# Altium project be_mdv.PrjPcb
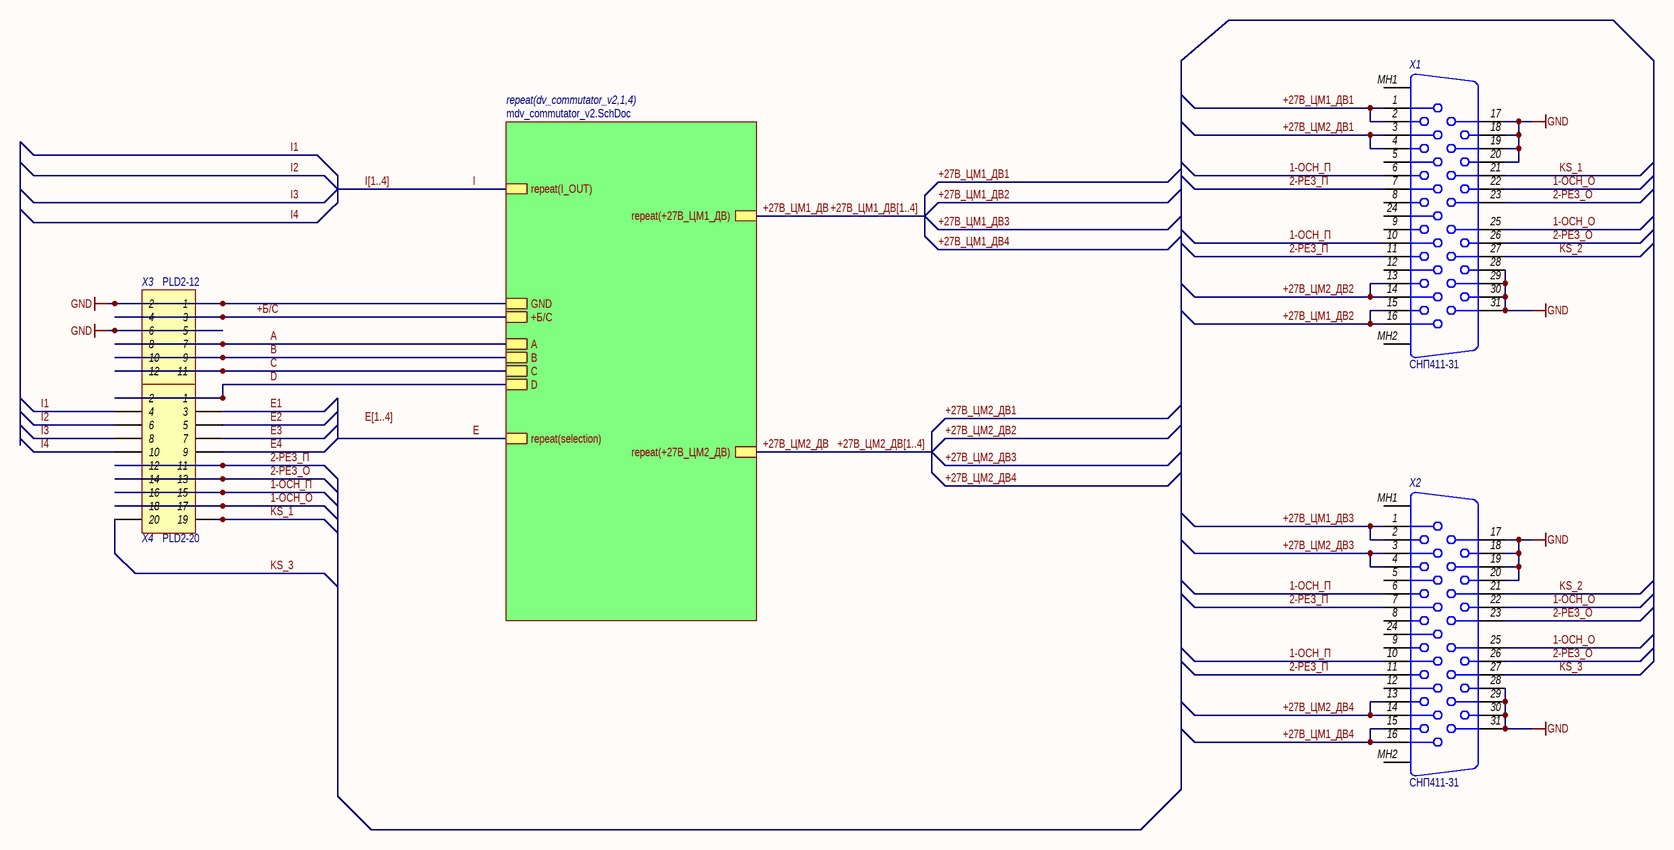
[diagram p0: be_mdv.SchDoc]
Утвердил: Прокопьев; Т.Контр.: Селезнев; Разработал: Пелемешко; Проверил: Стюф; Норм.Контр.: Задорожная; GlobalProjectRevision: #1.0; GlobalProjectNumber: ЮМП.250.270.041.05 Э3; GlobalProjectName3: Модуль датчиков вибрации; GlobalProjectName2: принципиальная.; GlobalProjectName1: Схема электрическая; GlobalOrganizationName: НГУ
2 sheets, 140 parts. Net scope: hierarchical (ports join the sheet entries above them; power ports are global).
Board file: be_mdv.PcbDoc
Sheets:
  be_mdv.SchDoc
    dv_commutator_v21 = mdv_commutator_v2.SchDoc
    dv_commutator_v22 = mdv_commutator_v2.SchDoc
    dv_commutator_v23 = mdv_commutator_v2.SchDoc
    dv_commutator_v24 = mdv_commutator_v2.SchDoc

## Sheet be_mdv.SchDoc: =GlobalProjectName
size 410 x 297 mm; ApprovedBy: Прокопьев; CheckedBy: Стюф; Author: Пелемешко; Organization: НГУ; DocumentNumber: 1; Revision: #1.0; SheetNumber: 1; SheetTotal: 2; PageSetup: Record=PageOptions|CenterHorizontal=True|CenterVertical=True|PrintScale=1.00|XCorrection=1.00|YCorrection=1.00|PrintKind=1|BorderSize=5000000|LeftOffset=0|BottomOffset=0|Orientation=2|PaperLength=1000|PaperWidth=1000|Scale=100|PaperSource=15|PrintQuality=1200|MediaType=1|DitherType=10|PaperKind=A3|PrintScaleMode=1; Weight: -; ScaleFactor: -; NormInspection: Задорожная; FirstApplication: ЮМП.250.270.041.05 Э3

### Parts
X1  SNP411-31  [SNP411-31]  (value not drawn)
X2  SNP411-31  [SNP411-31]  (value not drawn)
X3  Header 2X12  [PLD2-12]  (value not drawn)
X4  Header 2X20  [PLD2-20]  (value not drawn)

### Sub-sheets
repeat(dv_commutator_v2,1,4) = mdv_commutator_v2.SchDoc: repeat(+27В_ЦМ2_ДВ), GND, repeat(+27В_ЦМ1_ДВ), +Б/С, repeat(selection), A, C, B, D, repeat(I_OUT)

### Nets
GND: X1.17 X1.18 X1.19 X1.20 X1.28 X1.29 X1.30 X1.31 X2.17 X2.18 X2.19 X2.20 X2.28 X2.29 X2.30 X2.31 X3.1 X3.2 X3.5 X3.6 ; sheet repeat(dv_commutator_v2,1,4)/GND
1-ОСН_О: X1.22 X1.25 X2.22 X2.25 X4.17 X4.18
1-ОСН_П: X1.6 X1.10 X2.6 X2.10 X4.15 X4.16
2-РЕЗ_О: X1.23 X1.26 X2.23 X2.26 X4.13 X4.14
2-РЕЗ_П: X1.7 X1.11 X2.7 X2.11 X4.11 X4.12
+27В_ЦМ1_ДВ: sheet repeat(dv_commutator_v2,1,4)/repeat(+27В_ЦМ1_ДВ)  [also labelled +27В_ЦМ1_ДВ[1..4]]
+27В_ЦМ1_ДВ1: X1.1 X1.2  [also labelled +27В_ЦМ1_ДВ[1..4]1]
+27В_ЦМ1_ДВ2: X1.15 X1.16  [also labelled +27В_ЦМ1_ДВ[1..4]2]
+27В_ЦМ1_ДВ3: X2.1 X2.2  [also labelled +27В_ЦМ1_ДВ[1..4]3]
+27В_ЦМ1_ДВ4: X2.15 X2.16  [also labelled +27В_ЦМ1_ДВ[1..4]4]
+27В_ЦМ2_ДВ: sheet repeat(dv_commutator_v2,1,4)/repeat(+27В_ЦМ2_ДВ)  [also labelled +27В_ЦМ2_ДВ[1..4]]
+27В_ЦМ2_ДВ1: X1.3 X1.4  [also labelled +27В_ЦМ2_ДВ[1..4]1]
+27В_ЦМ2_ДВ2: X1.13 X1.14  [also labelled +27В_ЦМ2_ДВ[1..4]2]
+27В_ЦМ2_ДВ3: X2.3 X2.4  [also labelled +27В_ЦМ2_ДВ[1..4]3]
+27В_ЦМ2_ДВ4: X2.13 X2.14  [also labelled +27В_ЦМ2_ДВ[1..4]4]
+Б/С: X3.3 X3.4 ; sheet repeat(dv_commutator_v2,1,4)/+Б/С
A: X3.7 X3.8 ; sheet repeat(dv_commutator_v2,1,4)/A
B: X3.9 X3.10 ; sheet repeat(dv_commutator_v2,1,4)/B
C: X3.11 X3.12 ; sheet repeat(dv_commutator_v2,1,4)/C
D: X4.1 X4.2 ; sheet repeat(dv_commutator_v2,1,4)/D
E: sheet repeat(dv_commutator_v2,1,4)/repeat(selection)
E1: X4.3
E2: X4.5
E3: X4.7
E4: X4.9
I: sheet repeat(dv_commutator_v2,1,4)/repeat(I_OUT)
I1: X4.4
I2: X4.6
I3: X4.8
I4: X4.10
KS_1: X1.21 X4.19
KS_2: X1.27 X2.21
KS_3: X2.27 X4.20

Not connected (* = marked no-connect by the designer): X1 5 8 9 12 24 MH1 MH2; X2 5 8 9 12 24 MH1 MH2

### Buses and harness runs
bus E[1..4]
bus I[1..4]

### Notes on the sheet
- Labels drawn without touching a wire or pin: E[1..4]
- Перв. примен.
- Справ. №
- Подп. и дата
- Инв. № дубл.
- Взам. инв. №
- Изм.
- Разраб.
- Лист
- № докум.
- Подп.
- Дата
- Литера
- Масса
- Масштаб
- Пров.
- Т.контр.
- Листов
- Н.контр.
- Утв.
- Инв. № подл.
- Форма 1 ГОСТ 2.104-2006
- Копировал
- Формат А3

### Library data of the parts
X1 X2 = СНП411-31: СНП411-31, распиновка со стороны платы; Назначение: Соединитель угловой на плату; Наименование: СНП411-31
X3 = Header 2X12: Header, 12-Pin, Dual row; Потребление, Вт: 0,0; Назначение: Header, 12-Pin, Dual row; Наименование: PLD2-12
X4 = Header 2X20: Header, 20-Pin, Dual row; Потребление, Вт: 0,0; Назначение: Header, 20-Pin, Dual row; Наименование: PLD2-20

## Sheet mdv_commutator_v2.SchDoc
size 410 x 297 mm; DocumentNumber: 2; SheetNumber: 2; SheetTotal: 2; PageSetup: Record=PageOptions|CenterHorizontal=True|CenterVertical=True|PrintScale=1.00|XCorrection=1.00|YCorrection=1.00|PrintKind=1|BorderSize=5000000|LeftOffset=0|BottomOffset=0|Orientation=2|PaperLength=1000|PaperWidth=1000|Scale=100|PaperSource=15|PrintQuality=1200|MediaType=1|DitherType=10|PaperKind=A3|PrintScaleMode=1; Weight: -; ScaleFactor: -; NormInspection: Норм.Контр.; FirstApplication: ЮМП.250.270.041.05 Э3
Used 4 times, as channels dv_commutator_v21, dv_commutator_v22, dv_commutator_v23, dv_commutator_v24. Parts and nets are listed once, with the designators drawn on the sheet.
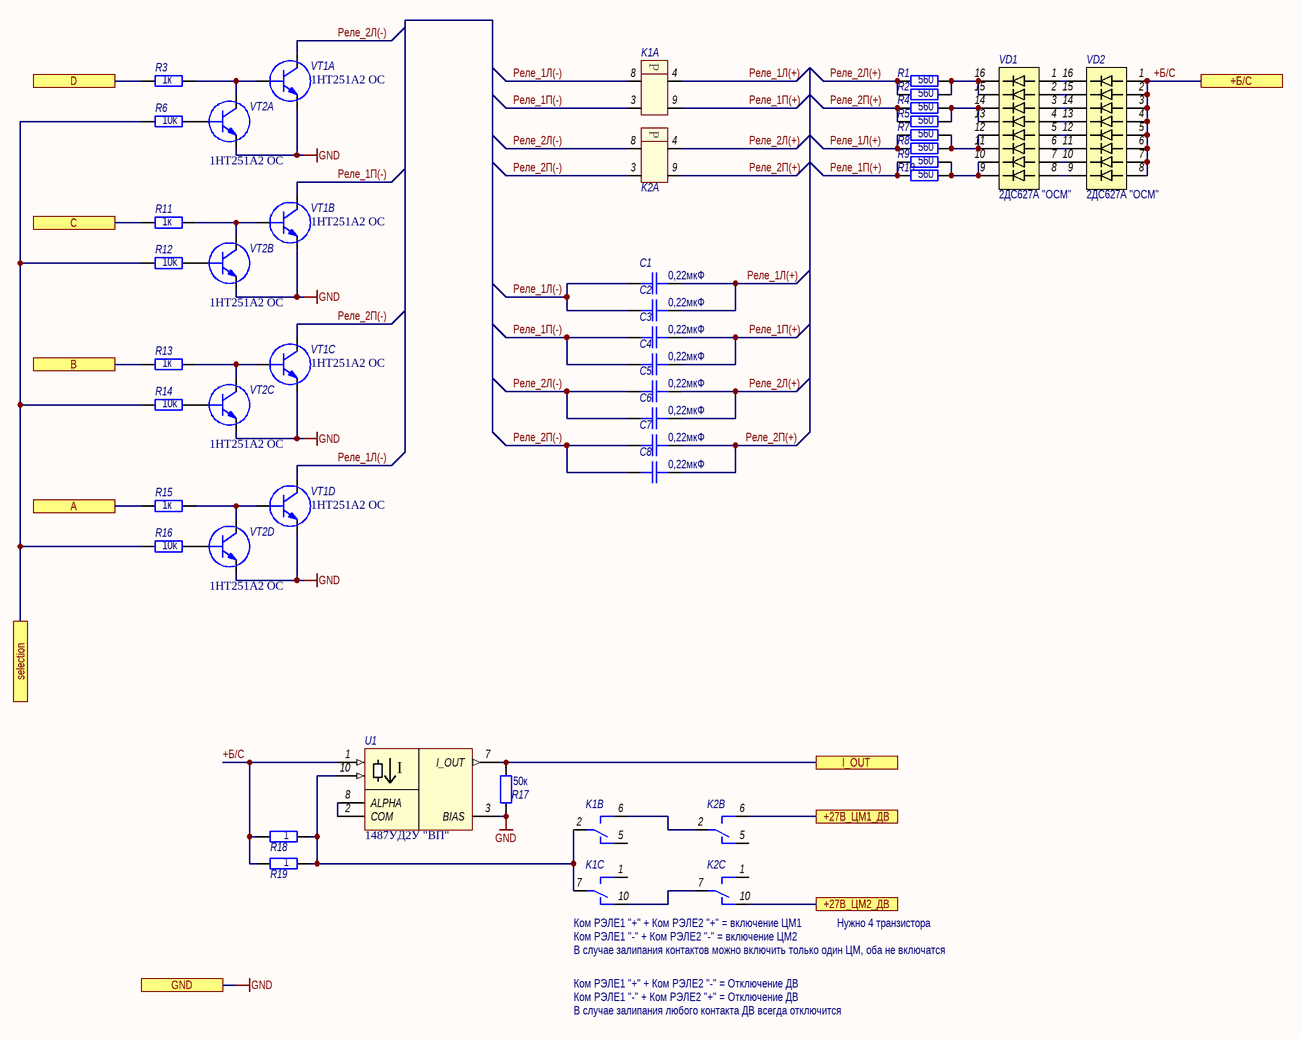
[diagram p1: mdv_commutator_v2.SchDoc]

### Parts
C1  value 0,22мкФ  [SMD_C0402]  (hidden comment: K10-79)
C2  value 0,22мкФ  [SMD_C0402]  (hidden comment: K10-79)
C3  value 0,22мкФ  [SMD_C0402]  (hidden comment: K10-79)
C4  value 0,22мкФ  [SMD_C0402]  (hidden comment: K10-79)
C5  value 0,22мкФ  [SMD_C0402]  (hidden comment: K10-79)
C6  value 0,22мкФ  [SMD_C0402]  (hidden comment: K10-79)
C7  value 0,22мкФ  [SMD_C0402]  (hidden comment: K10-79)
C8  value 0,22мкФ  [SMD_C0402]  (hidden comment: K10-79)
K1  RPS45-1-T-OS  [RPS-45-1]  (value not drawn)  (parts A,B,C of 3)
K2  RPS45-1-T-OS  [RPS-45-1]  (value not drawn)  (parts A,B,C of 3)
R1  value 560  [SMD_0805]  (hidden comment: OSM R1-12)
R2  value 560  [SMD_0805]  (hidden comment: OSM R1-12)
R3  value 1к  [SMD_0805]  (hidden comment: OSM R1-12)
R4  value 560  [SMD_0805]  (hidden comment: OSM R1-12)
R5  value 560  [SMD_0805]  (hidden comment: OSM R1-12)
R6  value 10k  [SMD_0805]  (hidden comment: OSM R1-12)
R7  value 560  [SMD_0805]  (hidden comment: OSM R1-12)
R8  value 560  [SMD_0805]  (hidden comment: OSM R1-12)
R9  value 560  [SMD_0805]  (hidden comment: OSM R1-12)
R10  value 560  [SMD_0805]  (hidden comment: OSM R1-12)
R11  value 1к  [SMD_0805]  (hidden comment: OSM R1-12)
R12  value 10k  [SMD_0805]  (hidden comment: OSM R1-12)
R13  value 1к  [SMD_0805]  (hidden comment: OSM R1-12)
R14  value 10k  [SMD_0805]  (hidden comment: OSM R1-12)
R15  value 1к  [SMD_0805]  (hidden comment: OSM R1-12)
R16  value 10k  [SMD_0805]  (hidden comment: OSM R1-12)
R17  value 50к  [SMD_0805]  (hidden comment: OSM R1-12)
R18  value 1  [SMD_0805]  (hidden comment: OSM R1-12)
R19  value 1  [SMD_0805]  (hidden comment: OSM R1-12)
U1  Наименование: 1487УД2У "ВП"  [FlatPack-10]  (hidden comment: 1487UD2U)
VD1  Наименование: 2ДС627А "ОСМ"  [401.16-3]  (hidden comment: 2DS627A OSM)
VD2  Наименование: 2ДС627А "ОСМ"  [401.16-3]  (hidden comment: 2DS627A OSM)
VT1  Наименование: 1НТ251А2 ОС  [FlatPack-14.PcbLib]  (hidden comment: 1NT251A2 OS)  (parts A,B,C,D of 4)
VT2  Наименование: 1НТ251А2 ОС  [FlatPack-14.PcbLib]  (hidden comment: 1NT251A2 OS)  (parts A,B,C,D of 4)

### Ports
+27В_ЦМ1_ДВ, +27В_ЦМ2_ДВ, +Б/С, A, B, C, D, GND, I_OUT, selection

### Nets
GND: R17.1 U1.3(BIAS) VT1.3(E) VT1.6(E) VT1.10(E) VT1.13(E) VT2.3(E) VT2.6(E) VT2.10(E) VT2.13(E) ; port GND
+27В_ЦМ1_ДВ: K2.6 ; port +27В_ЦМ1_ДВ
+27В_ЦМ2_ДВ: K2.10 ; port +27В_ЦМ2_ДВ
+Б/С: R18.2 R19.2 U1.1(V+) VD2.1(1A) VD2.2(1B) VD2.3(1C) VD2.4(1D) VD2.5(1E) VD2.6(1F) VD2.7(1G) VD2.8(1H) ; port +Б/С
A: R15.1 ; port A
B: R13.1 ; port B
C: R11.1 ; port C
D: R3.1 ; port D
I_OUT: R17.2 U1.7(I_OUT) ; port I_OUT
selection: R6.1 R12.1 R14.1 R16.1 ; port selection
Реле_1Л(+): C1.2 C2.2 K1.4 R7.1 R8.1
Реле_1Л(-): C1.1 C2.1 K1.8 VT1.7(C)
Реле_1П(+): C3.2 C4.2 K1.9 R9.1 R10.1
Реле_1П(-): C3.1 C4.1 K1.3 VT1.4(C)
Реле_2Л(+): C5.2 C6.2 K2.4 R1.1 R2.1
Реле_2Л(-): C5.1 C6.1 K2.8 VT1.14(C)
Реле_2П(+): C7.2 C8.2 K2.9 R4.1 R5.1
Реле_2П(-): C7.1 C8.1 K2.3 VT1.11(C)
NetK1_2: K1.2 K1.7 R18.1 R19.1 U1.10(V_SENSE)
NetK1_6: K1.6 K2.2
NetK1_10: K1.10 K2.7
NetR1_2: R1.2 R2.2 VD1.15(2B) VD1.16(2A)
NetR3_2: R3.2 VT1.2(B) VT2.14(C)
NetR4_2: R4.2 R5.2 VD1.13(2D) VD1.14(2C)
NetR6_2: R6.2 VT2.2(B)
NetR7_2: R7.2 R8.2 VD1.11(2F) VD1.12(2E)
NetR9_2: R9.2 R10.2 VD1.9(2G) VD1.10(2G)
NetR11_2: R11.2 VT1.12(B) VT2.4(C)
NetR12_2: R12.2 VT2.12(B)
NetR13_2: R13.2 VT1.5(B) VT2.11(C)
NetR14_2: R14.2 VT2.5(B)
NetR15_2: R15.2 VT1.9(B) VT2.7(C)
NetR16_2: R16.2 VT2.9(B)
NetU1_2: U1.2(COM) U1.8(ALPHA)
NetVD1_1: VD1.1(1A) VD2.16(2A)
NetVD1_2: VD1.2(1B) VD2.15(2B)
NetVD1_3: VD1.3(1C) VD2.14(2C)
NetVD1_4: VD1.4(1D) VD2.13(2D)
NetVD1_5: VD1.5(1E) VD2.12(2E)
NetVD1_6: VD1.6(1F) VD2.11(2F)
NetVD1_7: VD1.7(1G) VD2.10(2G)
NetVD1_8: VD1.8(1H) VD2.9(2G)

Not connected (* = marked no-connect by the designer): K1 1 5; K2 1 5

### Channels
dv_commutator_v21: designators C1=C1 C2=C2 C3=C3 C4=C4 C5=C5 C6=C6 C7=C7 C8=C8 K1=K1 K2=K2 R1=R2 R2=R3 R3=R1 R4=R4 R5=R6 R6=R5 R7=R7 R8=R8 R9=R9 R10=R10 R11=R11 R12=R12 R13=R13 R14=R14 R15=R15 R16=R16 R17=R17 R18=R18 R19=R19 U1=U1 VD1=VD1 VD2=VD2 VT1=VT2 VT2=VT1; ports +27В_ЦМ1_ДВ=+27В_ЦМ1_ДВ1 +27В_ЦМ2_ДВ=+27В_ЦМ2_ДВ1 +Б/С=+Б/С A=A B=B C=C D=D GND=GND I_OUT=I1 selection=E1
dv_commutator_v22: designators C1=C9 C2=C10 C3=C11 C4=C12 C5=C13 C6=C14 C7=C15 C8=C16 K1=K3 K2=K4 R1=R21 R2=R22 R3=R20 R4=R23 R5=R25 R6=R24 R7=R26 R8=R27 R9=R28 R10=R29 R11=R30 R12=R31 R13=R32 R14=R33 R15=R34 R16=R35 R17=R36 R18=R37 R19=R38 U1=U2 VD1=VD3 VD2=VD4 VT1=VT4 VT2=VT3; ports +27В_ЦМ1_ДВ=+27В_ЦМ1_ДВ2 +27В_ЦМ2_ДВ=+27В_ЦМ2_ДВ2 +Б/С=+Б/С A=A B=B C=C D=D GND=GND I_OUT=I2 selection=E2
dv_commutator_v23: designators C1=C17 C2=C18 C3=C19 C4=C20 C5=C21 C6=C22 C7=C23 C8=C24 K1=K5 K2=K6 R1=R40 R2=R41 R3=R39 R4=R42 R5=R44 R6=R43 R7=R45 R8=R46 R9=R47 R10=R48 R11=R49 R12=R50 R13=R51 R14=R52 R15=R53 R16=R54 R17=R55 R18=R56 R19=R57 U1=U3 VD1=VD5 VD2=VD6 VT1=VT6 VT2=VT5; ports +27В_ЦМ1_ДВ=+27В_ЦМ1_ДВ3 +27В_ЦМ2_ДВ=+27В_ЦМ2_ДВ3 +Б/С=+Б/С A=A B=B C=C D=D GND=GND I_OUT=I3 selection=E3
dv_commutator_v24: designators C1=C25 C2=C26 C3=C27 C4=C28 C5=C29 C6=C30 C7=C31 C8=C32 K1=K7 K2=K8 R1=R59 R2=R60 R3=R58 R4=R61 R5=R63 R6=R62 R7=R64 R8=R65 R9=R66 R10=R67 R11=R68 R12=R69 R13=R70 R14=R71 R15=R72 R16=R73 R17=R74 R18=R75 R19=R76 U1=U4 VD1=VD7 VD2=VD8 VT1=VT8 VT2=VT7; ports +27В_ЦМ1_ДВ=+27В_ЦМ1_ДВ4 +27В_ЦМ2_ДВ=+27В_ЦМ2_ДВ4 +Б/С=+Б/С A=A B=B C=C D=D GND=GND I_OUT=I4 selection=E4

### Notes on the sheet
- Ком РЭЛЕ1 "+" + Ком РЭЛЕ2 "+" = включение ЦМ1
- Ком РЭЛЕ1 "-" + Ком РЭЛЕ2 "-" = включение ЦМ2
- Нужно 4 транзистора
- Ком РЭЛЕ1 "+" + Ком РЭЛЕ2 "-" = Отключение ДВ
- Ком РЭЛЕ1 "-" + Ком РЭЛЕ2 "+" = Отключение ДВ
- В случае залипания контактов можно включить только один ЦМ, оба не включатся
- В случае залипания любого контакта ДВ всегда отключится
- Подп. и дата
- Инв. № дубл.
- Взам. инв. №
- Инв. № подл.
- Изм.
- Лист
- № докум.
- Подп.
- Дата
- Форма 2а ГОСТ 2.104-2006
- Копировал
- Формат А3
- (in symbol AD8212S) I
- (in symbol RPS45, part A) P

### Library data of the parts
C1-C8 = Capacitor: Назначение: SMD-конденсатор; Наименование: К10-79; Потребление, Вт: 0; Напряжение: В; Точность: %
K1 K2 = RPS45: Реле поляризованное; Потребление, Вт: 0,000; Наименование: РПС45-1-Т-ОС РС4.520.756-11; Назначение: Реле поляризованное; ComponentLink1Description: DataSheet; ComponentLink1URL: https://relays.ru/files/catalog/rps45.pdf
R1-R19 = Resistor: Наименование: ОСМ Р1-12; Назначение: SMD-резистор; Потребление, Вт: 0,001; Точность: %
U1 = AD8212S: Назначение: Токовый датчик
VD1 VD2 = 2DS627A: Диодная матрица; Потребление, Вт: 0,0; Назначение: Диодная матрица; ComponentLink1Description: DataSheet; ComponentLink1URL: https://www.integral.by/sites/default/files/pdf/2ds627a.pdf
VT1 VT2 = 1NT251A2 OS: Транзисторная сборка; Назначение: Транзисторная сборка

## Nets that join several sheets
GND: be_mdv (20 pins), dv_commutator_v21 (10 pins), dv_commutator_v22 (10 pins), dv_commutator_v23 (10 pins), dv_commutator_v24 (10 pins)
+27В_ЦМ1_ДВ1: be_mdv (X1.1 X1.2), dv_commutator_v21 (K2.6)
+27В_ЦМ1_ДВ2: be_mdv (X1.15 X1.16), dv_commutator_v22 (K4.6)
+27В_ЦМ1_ДВ3: be_mdv (X2.1 X2.2), dv_commutator_v23 (K6.6)
+27В_ЦМ1_ДВ4: be_mdv (X2.15 X2.16), dv_commutator_v24 (K8.6)
+27В_ЦМ2_ДВ1: be_mdv (X1.3 X1.4), dv_commutator_v21 (K2.10)
+27В_ЦМ2_ДВ2: be_mdv (X1.13 X1.14), dv_commutator_v22 (K4.10)
+27В_ЦМ2_ДВ3: be_mdv (X2.3 X2.4), dv_commutator_v23 (K6.10)
+27В_ЦМ2_ДВ4: be_mdv (X2.13 X2.14), dv_commutator_v24 (K8.10)
+Б/С: be_mdv (X3.3 X3.4), dv_commutator_v21 (11 pins), dv_commutator_v22 (11 pins), dv_commutator_v23 (11 pins), dv_commutator_v24 (11 pins)
A: be_mdv (X3.7 X3.8), dv_commutator_v21 (R15.1), dv_commutator_v22 (R34.1), dv_commutator_v23 (R53.1), dv_commutator_v24 (R72.1)
B: be_mdv (X3.9 X3.10), dv_commutator_v21 (R13.1), dv_commutator_v22 (R32.1), dv_commutator_v23 (R51.1), dv_commutator_v24 (R70.1)
C: be_mdv (X3.11 X3.12), dv_commutator_v21 (R11.1), dv_commutator_v22 (R30.1), dv_commutator_v23 (R49.1), dv_commutator_v24 (R68.1)
D: be_mdv (X4.1 X4.2), dv_commutator_v21 (R1.1), dv_commutator_v22 (R20.1), dv_commutator_v23 (R39.1), dv_commutator_v24 (R58.1)
E1: be_mdv (X4.3), dv_commutator_v21 (R5.1 R12.1 R14.1 R16.1)
E2: be_mdv (X4.5), dv_commutator_v22 (R24.1 R31.1 R33.1 R35.1)
E3: be_mdv (X4.7), dv_commutator_v23 (R43.1 R50.1 R52.1 R54.1)
E4: be_mdv (X4.9), dv_commutator_v24 (R62.1 R69.1 R71.1 R73.1)
I1: be_mdv (X4.4), dv_commutator_v21 (R17.2 U1.7)
I2: be_mdv (X4.6), dv_commutator_v22 (R36.2 U2.7)
I3: be_mdv (X4.8), dv_commutator_v23 (R55.2 U3.7)
I4: be_mdv (X4.10), dv_commutator_v24 (R74.2 U4.7)